# Altium schematic sheet TE0723.SchDoc: HM-CORE
size A4; Organization: HMLAB; Revision: A; SheetNumber: 1; SheetTotal: 12; Date: 08.07.2015; Author: Indrek Tubalkain; CompanyName: Trenz Electronic GmbH; DrawnBy: Indrek Tubalkain; Engineer: Indrek Tubalkain; ProjectName: TE0723 Arduino; Rule: PcbType=ProtelPcb
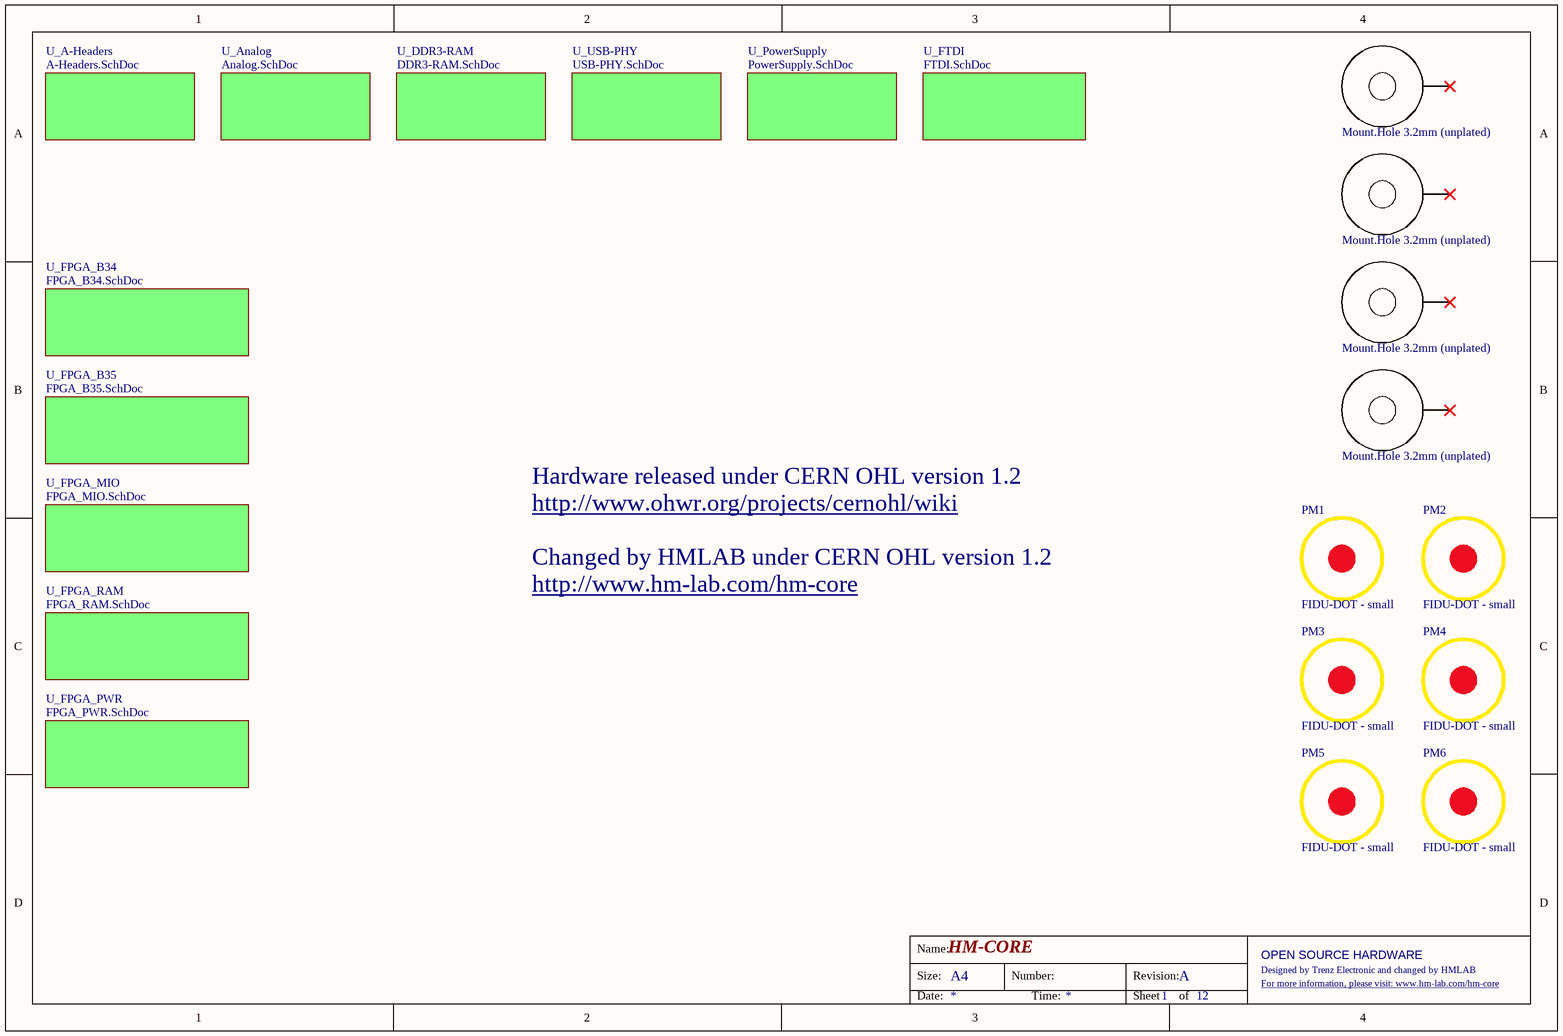
[diagram p0: TE0723.SchDoc]

## Parts
H1  Mount.Hole 3.2mm (unplated)  [MHole3_2mm-UNPLATED]  (no BOM)
H2  Mount.Hole 3.2mm (unplated)  [MHole3_2mm-UNPLATED]  (no BOM)
H3  Mount.Hole 3.2mm (unplated)  [MHole3_2mm-UNPLATED]  (no BOM)
H4  Mount.Hole 3.2mm (unplated)  [MHole3_2mm-UNPLATED]  (no BOM)
PM1  FIDU-DOT - small  [FIDU-DOT - small]
PM2  FIDU-DOT - small  [FIDU-DOT - small]
PM3  FIDU-DOT - small  [FIDU-DOT - small]
PM4  FIDU-DOT - small  [FIDU-DOT - small]
PM5  FIDU-DOT - small  [FIDU-DOT - small]
PM6  FIDU-DOT - small  [FIDU-DOT - small]

## Sub-sheets
U_A-Headers = A-Headers.SchDoc: no entries
U_Analog = Analog.SchDoc: no entries
U_DDR3-RAM = DDR3-RAM.SchDoc: no entries
U_FPGA_B34 = FPGA_B34.SchDoc: no entries
U_FPGA_B35 = FPGA_B35.SchDoc: no entries
U_FPGA_MIO = FPGA_MIO.SchDoc: no entries
U_FPGA_PWR = FPGA_PWR.SchDoc: no entries
U_FPGA_RAM = FPGA_RAM.SchDoc: no entries
U_FTDI = FTDI.SchDoc: no entries
U_PowerSupply = PowerSupply.SchDoc: no entries
U_USB-PHY = USB-PHY.SchDoc: no entries

## Nets

Not connected (* = marked no-connect by the designer): H1 1*; H2 1*; H3 1*; H4 1*

## Notes on the sheet
- Hardware released under CERN OHL version 1.2
- http://www.ohwr.org/projects/cernohl/wiki
- Changed by HMLAB under CERN OHL version 1.2
- http://www.hm-lab.com/hm-core
- Name:
- Size:
- A4
- Number:
- Revision:
- Designed by Trenz Electronic and changed by HMLAB
- OPEN SOURCE HARDWARE
- For more information, please visit: www.hm-lab.com/hm-core <http://hm-lab.com/hm-core>
- Date:
- Time:
- Sheet
- of

## Library data of the parts
H1-H4 = 24910: AN: 24910; Mixed: THT
PM1-PM6 = 22905: AN: 22905; Mixed: FIDU